# Altium schematic sheet batt_swap.SchDoc
size A; SheetNumber: 1; SheetTotal: 1
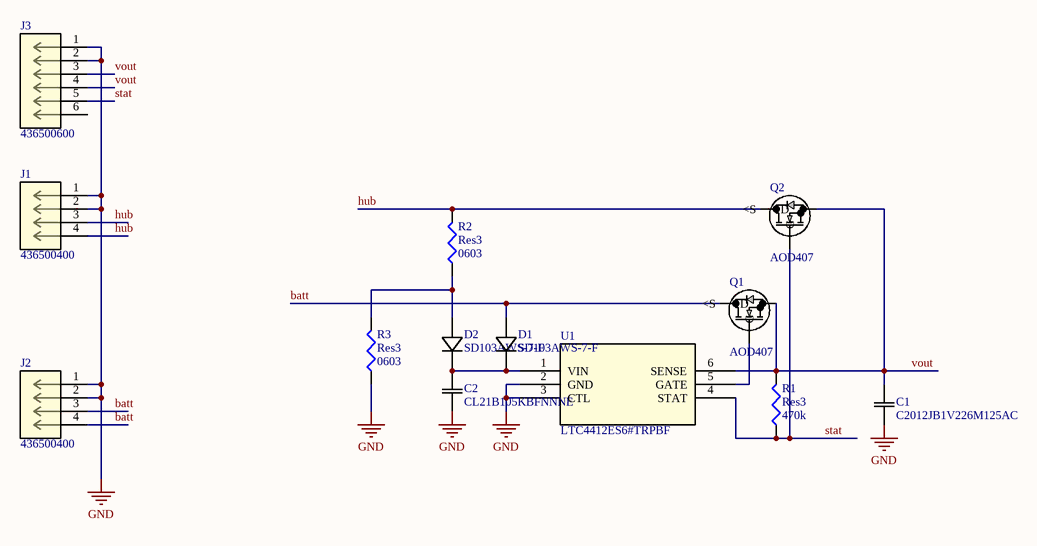
[diagram p0: batt_swap.SchDoc]

## Parts
C1  C2012JB1V226M125AC  [CAP_2012_TDK]
C2  CL21B105KBFNNNE  [CAP_CL21_SAM]
D1  SD103AWS-7-F  [SOD323_DIO]
D2  SD103AWS-7-F  [SOD323_DIO]
J1  436500400  [CON_436500400_MOL]
J2  436500400  [CON_436500400_MOL]
J3  436500600  [CON_436500600_MOL]
Q1  AOD407  [TO252_AOS]
Q2  AOD407  [TO252_AOS]
R1  Res3  value 470k  [J1-0603]
R2  Res3  value 0603  [J1-0603]
R3  Res3  value 0603  [J1-0603]
U1  LTC4412ES6#TRPBF  [LTC4412ES6#TRPBF_ADI]

## Nets
GND: C1.1 C2.1 J1.1 J1.2 J2.1 J2.2 J3.1 J3.2 R3.1 U1.2(GND) U1.3(CTL)
batt: D1.2 J2.3 J2.4 Q1.3(D)
hub: J1.3 J1.4 Q2.3(D) R2.2
stat: J3.5 Q2.1(G) R1.1 U1.4(STAT)
vout: C1.2 J3.3 J3.4 Q1.2(<S) Q2.2(<S) R1.2 U1.6(SENSE)
NetC2_2: C2.2 D1.1 D2.1 U1.1(VIN)
NetD2_2: D2.2 R2.1 R3.2
NetQ1_1: Q1.1(G) U1.5(GATE)

Not connected (* = marked no-connect by the designer): J3 6

## Library data of the parts
C1 = C2012JB1V226M125AC: No Description Available; Mfr_Name: TDK
C2 = CL21B105KBFNNNE: No Description Available; Mfr_Name: Samsung
D1 D2 = SD103AWS-7-F: No Description Available; Mfr_Name: Diodes Inc
J1 J2 = 436500400: No Description Available; Mfr_Name: Molex Connector Corporation; Copyright: Copyright (C) 2023 Ultra Librarian. All rights reserved.; Manufacturer_Part_Number: 436500400; RefDes: RefDes; Type: DEV
J3 = 436500600: No Description Available; Mfr_Name: Molex Connector Corporation; Copyright: Copyright (C) 2023 Ultra Librarian. All rights reserved.; Manufacturer_Part_Number: 436500600; RefDes: RefDes; Type: DEV
Q1 Q2 = AOD407: No Description Available; Mfr_Name: Alpha and Omega Semiconductor; Manufacturer_Part_Number: AOD256; Type: DEV; Copyright: Copyright (C) 2023 Ultra Librarian. All rights reserved.; RefDes: RefDes
R1-R3 = Res3: Resistor; Published: 8-Jun-2000; LatestRevisionDate: 29-May-2009; LatestRevisionNote: IPC-7351 Footprint Added.; PackageReference: J1-0603; Publisher: Altium Limited; PackageDescription: Chip Resistor
U1 = LTC4412ES6#TRPBF: No Description Available; Mfr_Name: Analog Devices Inc; RefDes: RefDes; Type: Type